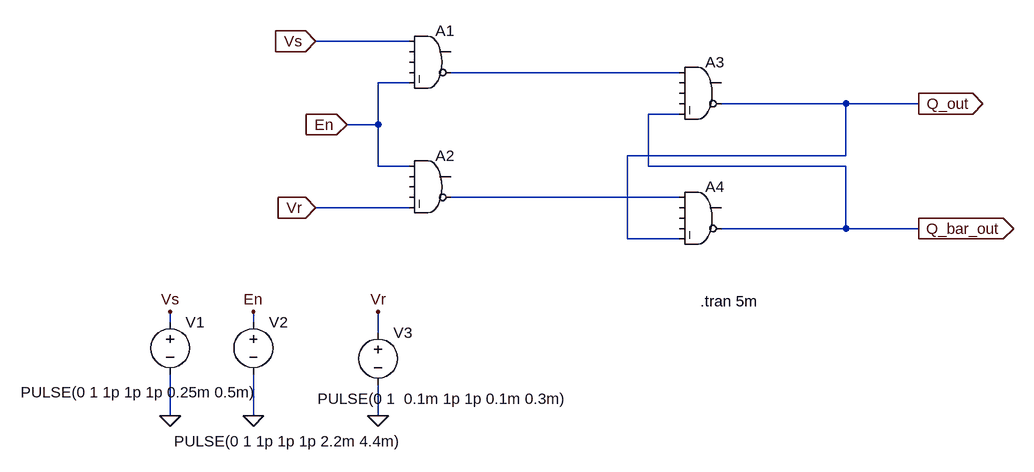
[diagram p0: schematic SRlatch_with_control.asc]
SRlatch_with_control.asc, the LTspice schematic file:
Version 4
SHEET 1 1080 728
WIRE 112 96 -32 96
WIRE 528 144 176 144
WIRE 112 160 64 160
WIRE 784 192 592 192
WIRE 896 192 784 192
WIRE 528 208 480 208
WIRE 64 224 64 160
WIRE 64 224 16 224
WIRE 784 272 784 192
WIRE 784 272 448 272
WIRE 64 288 64 224
WIRE 112 288 64 288
WIRE 480 288 480 208
WIRE 784 288 480 288
WIRE 528 336 176 336
WIRE 112 352 -32 352
WIRE 784 384 784 288
WIRE 784 384 592 384
WIRE 896 384 784 384
WIRE 448 400 448 272
WIRE 528 400 448 400
WIRE -256 528 -256 512
WIRE -128 528 -128 512
WIRE 64 544 64 512
WIRE -256 672 -256 608
WIRE -128 672 -128 608
WIRE 64 672 64 624
FLAG 896 192 Q_out
IOPIN 896 192 Out
FLAG 896 384 Q_bar_out
IOPIN 896 384 Out
FLAG 16 224 En
IOPIN 16 224 In
FLAG -32 96 Vs
IOPIN -32 96 In
FLAG -32 352 Vr
IOPIN -32 352 In
FLAG 64 672 0
FLAG -128 672 0
FLAG -256 672 0
FLAG -128 512 En
FLAG -256 512 Vs
FLAG 64 512 Vr
SYMBOL Digital\\and 144 64 R0
SYMATTR InstName A1
SYMBOL Digital\\and 144 256 R0
SYMATTR InstName A2
SYMBOL Digital\\and 560 112 R0
SYMATTR InstName A3
SYMBOL Digital\\and 560 304 R0
SYMATTR InstName A4
SYMBOL voltage -256 512 R0
WINDOW 3 -230 124 Left 2
SYMATTR Value PULSE(0 1 1p 1p 1p 0.25m 0.5m)
SYMATTR InstName V1
SYMBOL voltage -128 512 R0
WINDOW 3 -122 199 Left 2
SYMATTR Value PULSE(0 1 1p 1p 1p 2.2m 4.4m)
SYMATTR InstName V2
SYMBOL voltage 64 528 R0
WINDOW 3 -93 118 Left 2
SYMATTR Value PULSE(0 1  0.1m 1p 1p 0.1m 0.3m)
SYMATTR InstName V3
TEXT 560 496 Left 2 !.tran 5m

The netlist it stands for:
* SRlatch_with_control.asc
A1 Vs 0 0 0 En N001 0 0 AND
A2 En 0 0 0 Vr N002 0 0 AND
A3 N001 0 0 0 Q_bar_out Q_out 0 0 AND
A4 N002 0 0 0 Q_out Q_bar_out 0 0 AND
V1 Vs 0 PULSE(0 1 1p 1p 1p 0.25m 0.5m)
V2 En 0 PULSE(0 1 1p 1p 1p 2.2m 4.4m)
V3 Vr 0 PULSE(0 1  0.1m 1p 1p 0.1m 0.3m)
.tran 5m
.backanno
.end